# EasyEDA schematic 555 blinker led.json
TITLE: Sheet_1; REV: 1.0; Date: 2025-09-13; Sheet: 1/1; Company: Your Company
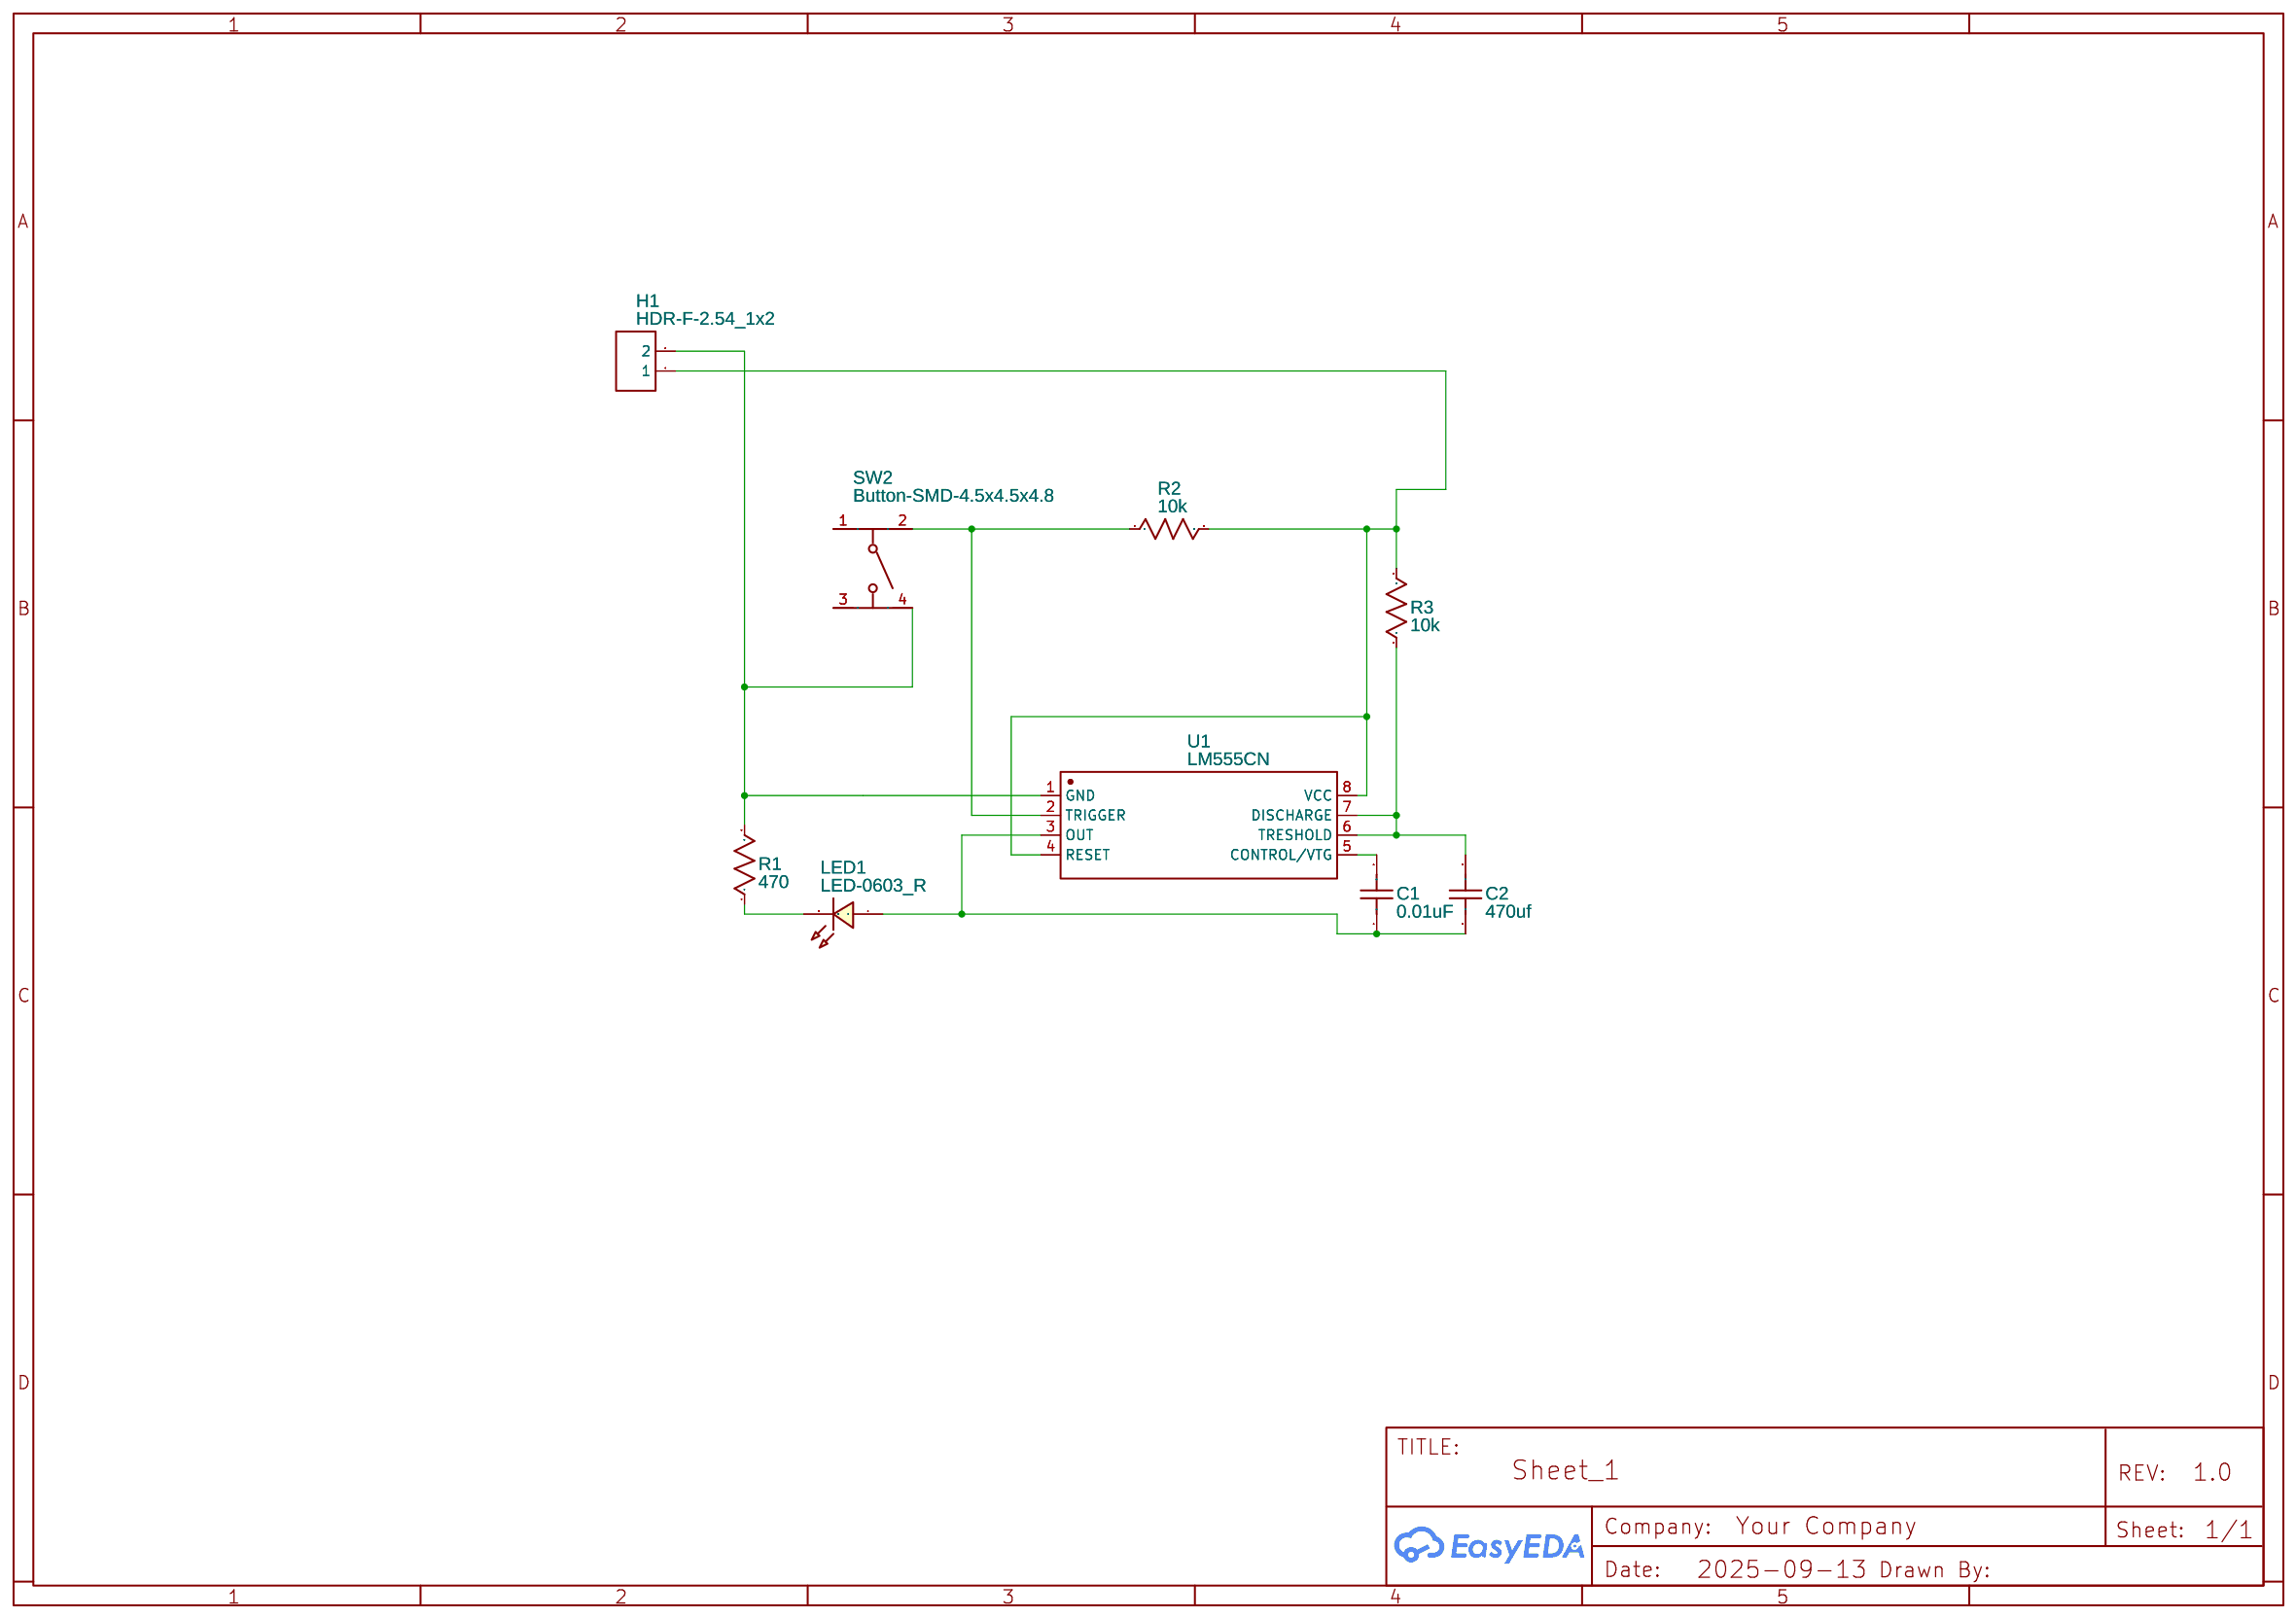
[diagram p0: schematic sheet]

## Parts
C1  0.01uF  [C0603]
C2  470uf  [C0603]
H1  HDR-F-2.54_1x2  [HDR-F-2.54_1X2]
LED1  LED-0603_R  [LED0603_RED]
R1  470  [R0603]
R2  10k  [R0603]
R3  10k  [R0603]
SW2  Button-SMD-4.5x4.5x4.8  [SW-SMD_4P-L4.5-W4.5-P3.00-LS7.0]
U1  LM555CN  [DIP-8_L9.7-W6.4-P2.54-LS7.6-BL]

## Library data of the parts
C1 C2 = C_0603_US: Contributor: LCEDA_Lib
H1 = HDR-F-2.54_1x2: Supplier Part: C49661; Supplier: LCSC; Contributor: LCEDA_Lib
LED1 = LED-0603_R: Manufacturer: EVERLIGHT(台湾亿光); Manufacturer Part: 19-217/R6C-AL1M2VY/3T; Supplier Part: C72044; Supplier: LCSC; Contributor: LCEDA_01
R1-R3 = R_0603_US: Contributor: LCEDA_Lib
SW2 = Button-SMD-4.5x4.5x4.8: Supplier: LCSC; Manufacturer: BBJ; Manufacturer Part: 4.5*4.5*4.8 Plastic head,260G, 0.25mm,SMD; Supplier Part: C71850; JLCPCB Part Class: Extended Part
U1 = LM555CN: Supplier: LCSC; Manufacturer: onsemi(安森美); Supplier Part: C110322; JLCPCB Part Class: Extended Part

## Nets
Net-(C1-1): C1.1 C2.1 LED1.1 U1.3(OUT)
Net-(C1-2): C1.2 U1.5(CONTROL/VTG)
Net-(C2-2): C2.2 R3.1 U1.6(TRESHOLD) U1.7(DISCHARGE)
Net-(H1-1): H1.1 R2.2 R3.2 U1.4(RESET) U1.8(VCC)
Net-(H1-2): H1.2 R1.2 SW2.4 U1.1(GND)
Net-(LED1-2): LED1.2 R1.1
Net-(R2-1): R2.1 SW2.2 U1.2(TRIGGER)

Not connected (* = marked no-connect by the designer): SW2 1 3
